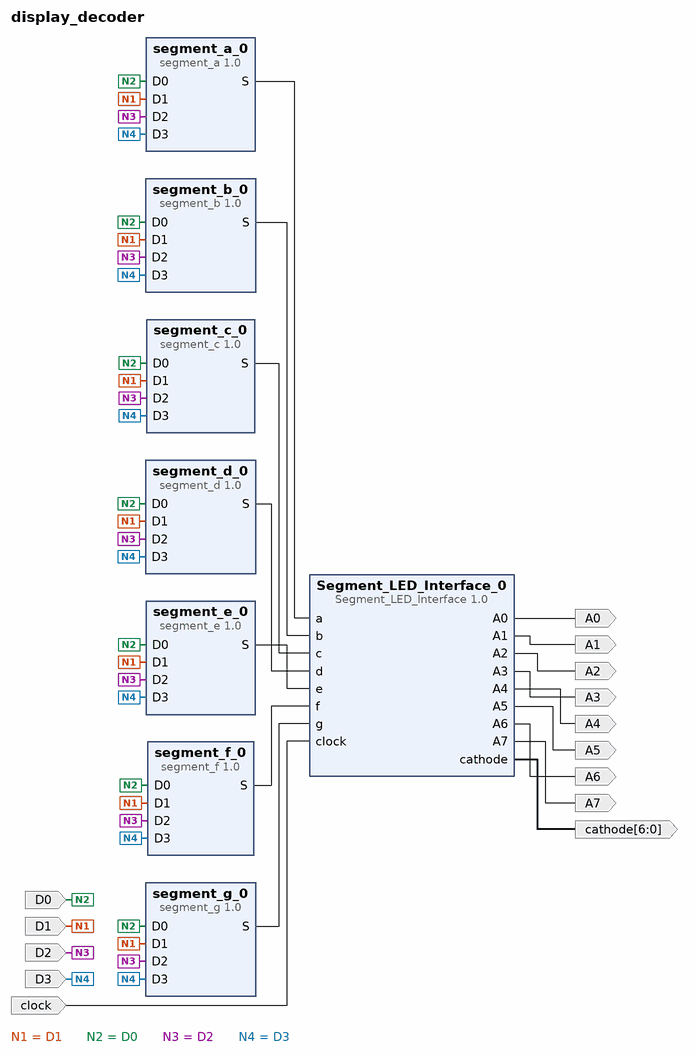
[diagram p0: block diagram of the top level]
# Vivado block design display_decoder, xc7a100tcsg324-1, Vivado 2019.2
create_bd_design display_decoder

create_bd_port -dir O A0
create_bd_port -dir O A3
create_bd_port -dir O A2
create_bd_port -dir O A5
create_bd_port -dir O A4
create_bd_port -dir O A7
create_bd_port -dir O A6
create_bd_port -dir O A1
create_bd_port -dir I -type clk clock
create_bd_port -dir O -from 6 -to 0 cathode
create_bd_port -dir I D0
create_bd_port -dir I D1
create_bd_port -dir I D2
create_bd_port -dir I D3

create_bd_cell -type ip -vlnv xilinx.com:user:segment_a:1.0 segment_a_0
create_bd_cell -type ip -vlnv xilinx.com:user:segment_b:1.0 segment_b_0
create_bd_cell -type ip -vlnv xilinx.com:user:segment_c:1.0 segment_c_0
create_bd_cell -type ip -vlnv xilinx.com:user:segment_d:1.0 segment_d_0
create_bd_cell -type ip -vlnv xilinx.com:user:segment_e:1.0 segment_e_0
create_bd_cell -type ip -vlnv xilinx.com:user:segment_f:1.0 segment_f_0
create_bd_cell -type ip -vlnv xilinx.com:user:segment_g:1.0 segment_g_0
create_bd_cell -type ip -vlnv asu.edu:user:Segment_LED_Interface:1.0 Segment_LED_Interface_0

# ---- connections ----

connect_bd_net [get_bd_pins Segment_LED_Interface_0/A0] [get_bd_ports A0]
connect_bd_net [get_bd_pins Segment_LED_Interface_0/A3] [get_bd_ports A3]
connect_bd_net [get_bd_pins Segment_LED_Interface_0/A2] [get_bd_ports A2]
connect_bd_net [get_bd_pins Segment_LED_Interface_0/A5] [get_bd_ports A5]
connect_bd_net [get_bd_pins Segment_LED_Interface_0/A4] [get_bd_ports A4]
connect_bd_net [get_bd_pins Segment_LED_Interface_0/A7] [get_bd_ports A7]
connect_bd_net [get_bd_pins Segment_LED_Interface_0/A6] [get_bd_ports A6]
connect_bd_net [get_bd_pins Segment_LED_Interface_0/A1] [get_bd_ports A1]
connect_bd_net -net clock_0_1 [get_bd_ports clock] [get_bd_pins Segment_LED_Interface_0/clock]
connect_bd_net -net D1_0_1 [get_bd_ports D1] \
  [get_bd_pins segment_a_0/D1] [get_bd_pins segment_b_0/D1] [get_bd_pins segment_c_0/D1] [get_bd_pins segment_d_0/D1] \
  [get_bd_pins segment_e_0/D1] [get_bd_pins segment_f_0/D1] [get_bd_pins segment_g_0/D1]
connect_bd_net -net D0_0_1 [get_bd_ports D0] \
  [get_bd_pins segment_a_0/D0] [get_bd_pins segment_b_0/D0] [get_bd_pins segment_c_0/D0] [get_bd_pins segment_d_0/D0] \
  [get_bd_pins segment_e_0/D0] [get_bd_pins segment_f_0/D0] [get_bd_pins segment_g_0/D0]
connect_bd_net -net D2_0_1 [get_bd_ports D2] \
  [get_bd_pins segment_a_0/D2] [get_bd_pins segment_b_0/D2] [get_bd_pins segment_c_0/D2] [get_bd_pins segment_d_0/D2] \
  [get_bd_pins segment_e_0/D2] [get_bd_pins segment_f_0/D2] [get_bd_pins segment_g_0/D2]
connect_bd_net -net D3_0_1 [get_bd_ports D3] \
  [get_bd_pins segment_a_0/D3] [get_bd_pins segment_b_0/D3] [get_bd_pins segment_c_0/D3] [get_bd_pins segment_d_0/D3] \
  [get_bd_pins segment_e_0/D3] [get_bd_pins segment_f_0/D3] [get_bd_pins segment_g_0/D3]
connect_bd_net [get_bd_pins segment_a_0/S] [get_bd_pins Segment_LED_Interface_0/a]
connect_bd_net [get_bd_pins segment_b_0/S] [get_bd_pins Segment_LED_Interface_0/b]
connect_bd_net [get_bd_pins segment_c_0/S] [get_bd_pins Segment_LED_Interface_0/c]
connect_bd_net [get_bd_pins segment_d_0/S] [get_bd_pins Segment_LED_Interface_0/d]
connect_bd_net [get_bd_pins segment_e_0/S] [get_bd_pins Segment_LED_Interface_0/e]
connect_bd_net [get_bd_pins segment_f_0/S] [get_bd_pins Segment_LED_Interface_0/f]
connect_bd_net [get_bd_pins segment_g_0/S] [get_bd_pins Segment_LED_Interface_0/g]
connect_bd_net [get_bd_pins Segment_LED_Interface_0/cathode] [get_bd_ports cathode]

validate_bd_design
save_bd_design
